# Altium project Cubesat Battery Board.PrjPcb
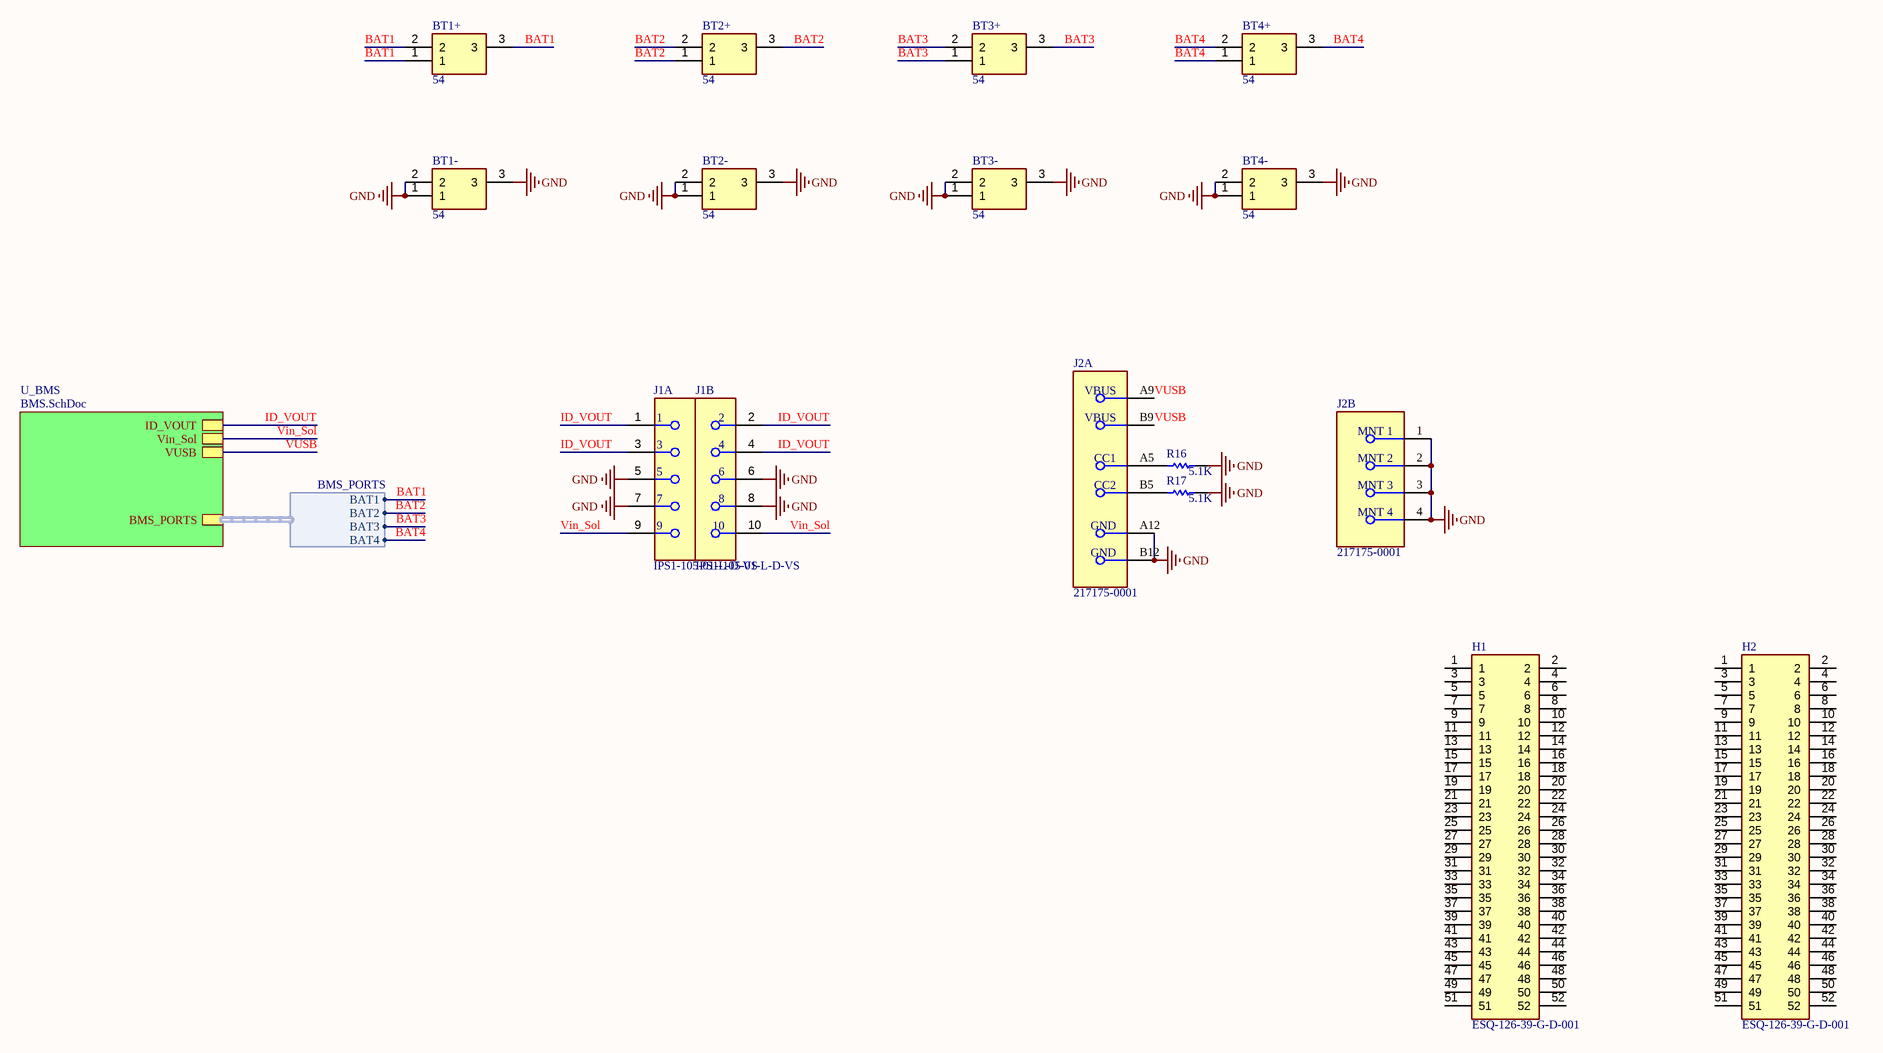
[diagram p0: Top.SchDoc]
CAGE_CODE: ?????; CONTRACT_NUMBER: <CONTRACT NO>; DOC_NO_ASSY_DWG: <ASSY DWG NO>; DOC_NO_BOM: <BOM DOC NO>; DOC_NO_FAB_DWG: <FAB DWG NO>; DOC_NO_SCH_DWG: <SCH DWG NO>; PCB_2_DEC_TOL: +/-.01; PCB_3_DEC_TOL: +/-.010; PCB_ANG_TOL: +/-1/2; PCB_ASSEMBLY_NO: <PCB ASSY NO>; PCB_CHECKER: - -----; PCB_CHECKER_APP_DATE: --/--/----; PCB_DESIGNER: - -----; PCB_DESIGNER_APP_DATE: --/--/----; PCB_DWG_NO: <PCB DWG NO>; PCB_ENGINEER: - -----; PCB_ENGINEER_APP_DATE: --/--/----; PCB_PART_NUMBER: <PCB PN>; PCB_REV: A; SCH_REV: A
1 sheet, 14 parts. Net scope: hierarchical (ports join the sheet entries above them; power ports are global).
Board files: batterypack_A.PcbDoc, batterypack_B.PcbDoc

## Sheet Top.SchDoc
size 420 x 297 mm; SheetNumber: 1; SheetTotal: 3

### Parts
BT1+  54  [54]
BT1-  54  [54]
BT2+  54  [54]
BT2-  54  [54]
BT3+  54  [54]
BT3-  54  [54]
BT4+  54  [54]
BT4-  54  [54]
H1  ESQ-126-39-G-D-001  [RHDR52W64P254_2X26_6654X495X1135P]
H2  ESQ-126-39-G-D-001  [RHDR52W64P254_2X26_6654X495X1135P]
J1  IPS1-105-01-L-D-VS  [FP-IPS1-105-01-L-D-VS-MFG]  (parts A,B of 2)
J2  217175-0001  [FP-217175-0001-MFG]  (parts A,B of 2)
R16  5.1K  [RESC1608X55X30LL15T15]
R17  5.1K  [RESC1608X55X30LL15T15]

### Sub-sheets
U_BMS = BMS.SchDoc (file not in this document): ID_VOUT, Vin_Sol, BMS_PORTS (harness BMS_PORTS), VUSB

### Harnesses
BMS_PORTS: BAT1, BAT2, BAT3, BAT4

### Nets
GND: BT1-.1 BT1-.2 BT1-.3 BT2-.1 BT2-.2 BT2-.3 BT3-.1 BT3-.2 BT3-.3 BT4-.1 BT4-.2 BT4-.3 J1.5 J1.6 J1.7 J1.8 J2.1(MNT_1) J2.2(MNT_2) J2.3(MNT_3) J2.4(MNT_4) J2.A12(GND) J2.B12(GND) R16.2 R17.2
BAT1: BT1+.1 BT1+.2 BT1+.3 ; sheet U_BMS/BMS_PORTS.BAT1
BAT2: BT2+.1 BT2+.2 BT2+.3 ; sheet U_BMS/BMS_PORTS.BAT2
BAT3: BT3+.1 BT3+.2 BT3+.3 ; sheet U_BMS/BMS_PORTS.BAT3
BAT4: BT4+.1 BT4+.2 BT4+.3 ; sheet U_BMS/BMS_PORTS.BAT4
ID_VOUT: J1.1 J1.2 J1.3 J1.4 ; sheet U_BMS/ID_VOUT
Vin_Sol: J1.9 J1.10 ; sheet U_BMS/Vin_Sol
VUSB: J2.A9(VBUS) J2.B9(VBUS) ; sheet U_BMS/VUSB
NetJ2_A5: J2.A5(CC1) R16.1
NetJ2_B5: J2.B5(CC2) R17.1

Not connected (* = marked no-connect by the designer): H1 1 2 3 4 5 6 7 8 9 10 11 12 13 14 15 16 17 18 19 20 21 22 23 24 25 26 27 28 29 30 31 32 33 34 35 36 37 38 39 40 41 42 43 44 45 46 47 48 49 50 51 52; H2 1 2 3 4 5 6 7 8 9 10 11 12 13 14 15 16 17 18 19 20 21 22 23 24 25 26 27 28 29 30 31 32 33 34 35 36 37 38 39 40 41 42 43 44 45 46 47 48 49 50 51 52

### Notes on the sheet
- THIS DOCUMENT AND THE DATA DISCLOSED HEREIN OR
- HEREWITH IS THE PROPERTY OF ALTIUM LIMITED AND MAY
- DWG NO:
- REVISION
- REV:
- DESCRIPTION
- DATE
- APPROVED
- BE FREELY DISTRIBUTED IN WHOLE. NO RIGHTS ARE
- RESERVED OR EXPRESS OR IMPLIED WARANTEE GIVEN.
- ENG:
- APPROVALS
- PROJECT
- DSN:
- CHK:
- REFERENCE DOCUMENTS
- PROJECT REVISION:
- TITLE
- DOCUMENT REVISION:
- DESIGN ITEM:
- BOM:
- FAB DWG:
- PCB DWG:
- ASSY DWG:
- SCALE:
- A3
- SIZE
- CAGE CODE
- FILE NAME
- DWG NO.
- SHEET
- OF
- REV

### Library data of the parts
BT1+ BT1- BT2+ BT2- BT3+ BT3- BT4+ BT4- = CMP-00029-00001-1: Battery; Manufacturer_Name: Keystone Electronics; Mouser Part Number: 534-54; Height: 16.97mm; Manufacturer_Part_Number: 54; Source: SamacSys.SchLib; Arrow Price/Stock: https://www.arrow.com/en/products/54/keystone-electronics?utm_currency=USD&region=europe; Datasheet Link: http://www.keyelco.com/product-pdf.cfm?p=826; Design Item ID: 54; Mouser Price/Stock: https://www.mouser.co.uk/ProductDetail/Keystone-Electronics/54?qs=73q%2FgRcW4F3NakoJDesViw%3D%3D; Arrow Part Number: 54
H1 H2 = CMP-002-00086-1: PC / 104 Connectors Elevated Socket Strip; Manufacturer_Name: SAMTEC; Design Item ID: ESQ-126-39-G-D-001; Mouser Price/Stock: https://www.mouser.co.uk/ProductDetail/Samtec/ESQ-126-39-G-D-001?qs=PB6%2FjmICvI2K%2FCIgL4SVbg%3D%3D; Mouser Part Number: 200-ESQ12639GD001; Source: SamacSys.SchLib; Arrow Price/Stock: https://www.arrow.com/en/products/esq-126-39-g-d-001/samtec?region=nac; Arrow Part Number: ESQ-126-39-G-D-001; Manufacturer_Part_Number: ESQ-126-39-G-D-001; Datasheet Link: http://suddendocs.samtec.com/catalog_english/esq_th.pdf; Height: 11.35mm
J1 = CMP-02766-000002-1: CONN RCPT 10POS 0.1 GOLD SMD; Manufacturer: Samtec; Standoff Height: 1.02mm; Is Female: yes; Voltage Rating: 1095V; Conn Orientation: Vertical; Conn Gender: Female; Pitch: 2.54mm; Number Of Contacts: 10; Package: 0; Category: Conn; Automotive: No; Height: 8.64mm; Temperature Range High: +125°C; Device Class L3: unset; Number Of Rows: 2; Device Class L2: Headers and Wire Housings; Device Class L1: Connectors; RoHS: TRUE; Temperature Range Low: -55°C; Octopart: https://octopart.com/ips1-105-01-l-d-vs-samtec-19544880; Temperature: -55°C to +125°C; Contact Material: Gold,Nickel; Digikey Description: CONN RCPT 10POS 0.1 GOLD SMD; Manufacturer Part Number: IPS1-105-01-L-D-VS; ComponentLink2URL: http://suddendocs.samtec.com/prints/ips1-1xx-xx-xx-d-vs-xx-xx-mkt.pdf; Footprint Url: http://suddendocs.samtec.com/prints/ips1-vs.pdf; ComponentLink2Description: Datasheet; Lead Free: Yes
J2 = CMP-04767-000026-1: CONN RCP USB2.0 C 6+18P SMD RA
R16 R17 = CMP-2000-00803-1: Part Number: ERJ-3GEYJ512V; Manufacturer: Panasonic